# Altium schematic sheet E-O Converter.SchDoc
size 406 x 304 mm; SheetNumber: 6; SheetTotal: 6
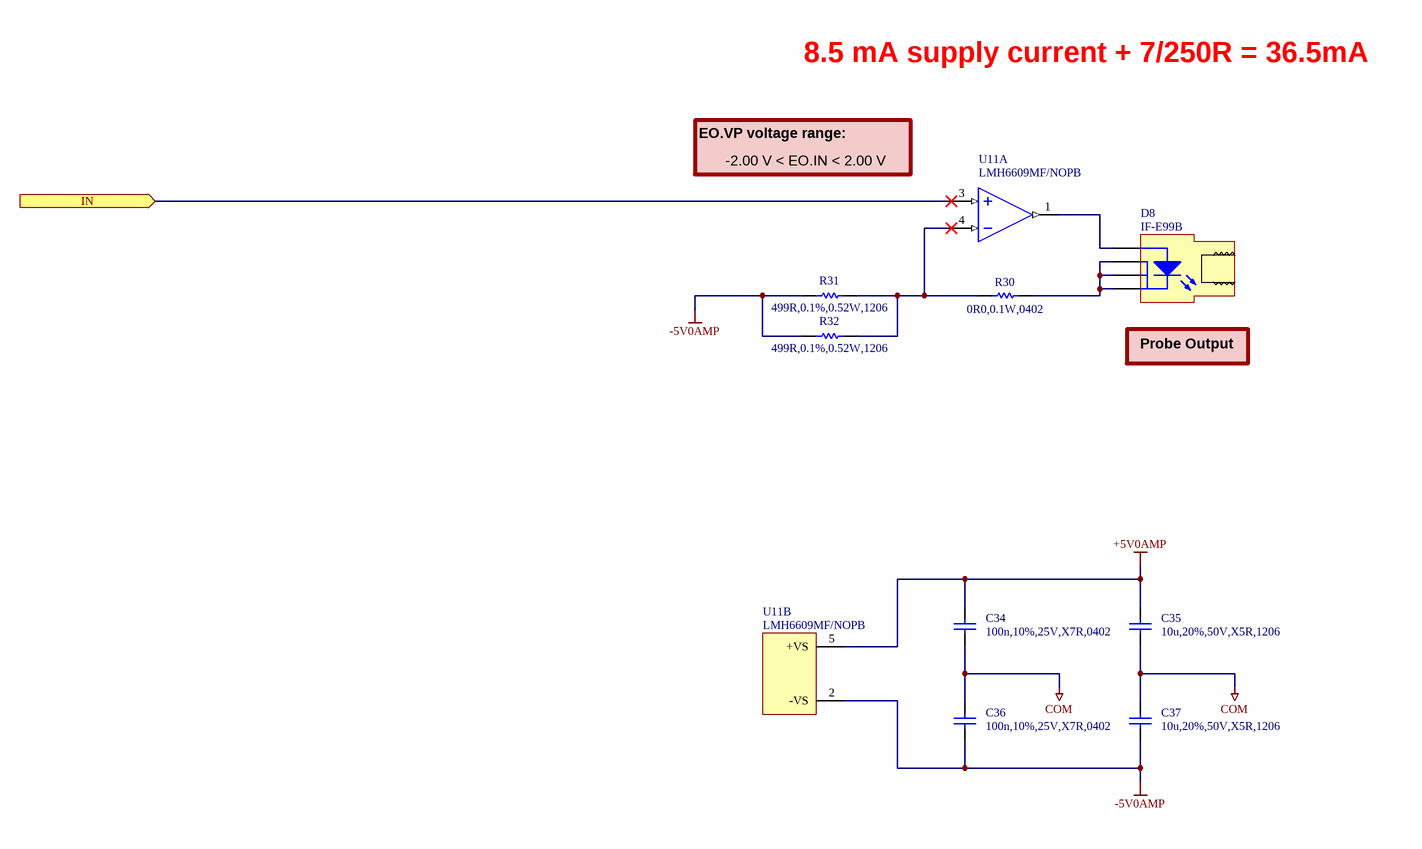
[diagram p0: E-O Converter.SchDoc]

## Parts
C34  100n,10%,25V,X7R,0402  [CAPC1005X06N]
C35  10u,20%,50V,X5R,1206  [CAPC3216X16N]
C36  100n,10%,25V,X7R,0402  [CAPC1005X06N]
C37  10u,20%,50V,X5R,1206  [CAPC3216X16N]
D8  IF-E99B  [INDUSTRIALFIBEROPTICS_IF-E99B]
R30  0R0,0.1W,0402  [RESC1005X04N]
R31  499R,0.1%,0.52W,1206  [VISHAY_PKG_TNPW1206]
R32  499R,0.1%,0.52W,1206  [VISHAY_PKG_TNPW1206]
U11  LMH6609MF/NOPB  [TEXASINSTRUMENTS_PKG_DBV0005A]  (parts A,B of 2)

## Ports
IN (in)

## Nets
+5V0AMP: C34.2 C35.2 U11.5(+VS)
-5V0AMP: C36.1 C37.1 R31.1 R32.1 U11.2(-VS)
COM: C34.1 C35.1 C36.2 C37.2
IN: U11.3(IN+) ; port IN
NetD8_1: D8.1(K) D8.2(K) D8.4(K) R30.2
NetD8_3: D8.3(A) U11.1(OUT1)
NetR30_1: R30.1 R31.2 R32.2 U11.4(IN-)

## Notes on the sheet
- 8.5 mA supply current + 7/250R = 36.5mA
- -2.00 V < EO.IN < 2.00 V
- EO.VP voltage range:
- (near D8) Probe Output
- Rev
- Sheet Name:
- Date:
- Sheet
- Designer:
- of

## Library data of the parts
C34 C36 = CAP,Cer,100nF,10%,25V,X7R,0402: 0.1ï¿½F ï¿½10% 25V Ceramic Capacitor X7R 0402 (1005 Metric); Manufacturer 1: Murata Electronics; Manufacturer 1 Part Number: GRM155R71E104KE14J; Vendor 1 Part Number: 490-14603-1-ND; Vendor 1: DigiKey; Value: 100nF; Part Name: CAP,Cer,100nF,10%,25V,X7R,0402; CreatedBy: Judd Foster; HelpURL: https://search.murata.co.jp/Ceramy/image/img/A01X/G101/ENG/GRM155R71E104KE14-01.pdf
C35 C37 = CAP,Cer,10uF,50VDC,X5R,1206: 10ï¿½F ï¿½20% 50V Ceramic Capacitor X5R 1206 (3216 Metric); Manufacturer 1: Samsung Electro-Mechanics; Manufacturer 1 Part Number: CL31A106MBHNNNE; Vendor 1 Part Number: 1276-6736-1-ND; Vendor 1: Digikey; Part Name: CAP,Cer,10uF,50VDC,X5R,1206; CreatedBy: Judd Foster; HelpURL: https://www.samsungsem.com/resources/file/global/support/product_catalog/MLCC.pdf; Value: 10u
D8 = XMITTER,FIBER OPTIC,650NM,1.9V,IF-E99B: Fiber Optic Transmitter 650nm 1.9V 50 mA Connector-less; Manufacturer 1: Industrial Fiber Optics; Vendor 1 Part Number: FB161-ND; Vendor 1: DigiKey; Part Name: XMITTER,FIBER OPTIC,650NM,1.9V,IF-E99B; CreatedBy: Judd Foster; HelpURL: https://i-fiberoptics.com/pdf/if-e99bdatasheet.pdf; Manufacturer 1 Part Number: IF-E99B
R30 = RES,0R0,0.1W,0402: 0 Ohms Jumper 0.1W, 1/10W Chip Resistor 0402 (1005 Metric) Automotive AEC-Q200 Thick Film; Manufacturer 1: Panasonic Electronic Components; Manufacturer 1 Part Number: ERJ-2GE0R00X; Vendor 1 Part Number: P0.0JCT-ND; Vendor 1: Digikey; Value: 0R; Part Name: RES,0R0,0.1W,0402; CreatedBy: Judd Foster; HelpURL: https://industrial.panasonic.com/cdbs/www-data/pdf/RDA0000/AOA0000C301.pdf
R31 R32 = RES,499R,0.1%,0.52W,1206: 499 Ohms Â±0.1% 0.52W Chip Resistor 1206 (3216 Metric) Anti-Sulfur, Automotive AEC-Q200, Moisture Resistant Thin Film; Manufacturer 1: Vishay Dale; Manufacturer 1 Part Number: TNPW1206499RBEEA; Vendor 1 Part Number: 541-3877-1-ND; Vendor 1: DigiKey; Part Name: RES,499R,0.1%,0.52W,1206; CreatedBy: Judd Foster; HelpURL: https://www.vishay.com/docs/28758/tnpw_e3.pdf; Value: 499R
U11 = LMH6609MF_NOPB: Voltage Feedback Amplifier 1 Circuit SOT-23-5; Manufacturer 1: Texas Instruments; Vendor 1 Part Number: LMH6609MF/NOPBCT-ND; Vendor 1: DigiKey; Part Name: LMH6609MF_NOPB; CreatedBy: Judd Foster; HelpURL: https://www.ti.com/lit/ds/symlink/lmh6609.pdf; Manufacturer 1 Part Number: LMH6609MF/NOPB